# Altium schematic sheet HexSwitch.SchDoc
size A
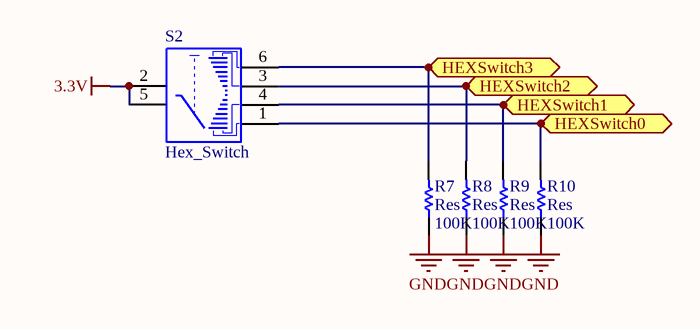
[diagram p0: HexSwitch.SchDoc]

## Parts
R7  Res  value 100K  [2012[0805]]
R8  Res  value 100K  [2012[0805]]
R9  Res  value 100K  [2012[0805]]
R10  Res  value 100K  [2012[0805]]
S2  Hex_Switch  [SW-HEX]

## Ports
HEXSwitch0 (out), HEXSwitch1 (out), HEXSwitch2 (out), HEXSwitch3 (out)

## Nets
3.3V: S2.2 S2.5
GND: R7.1 R8.1 R9.1 R10.1
HEXSwitch0: R10.2 S2.1 ; port HEXSwitch0
HEXSwitch1: R9.2 S2.4 ; port HEXSwitch1
HEXSwitch2: R8.2 S2.3 ; port HEXSwitch2
HEXSwitch3: R7.2 S2.6 ; port HEXSwitch3

## Library data of the parts
R7-R10 = Res: Semiconductor Resistor; Published: 8-Jun-2000; LatestRevisionDate: 17-Jul-2002; LatestRevisionNote: Re-released for DXP Platform.; PackageReference: AXIAL-0.5; Publisher: Altium Limited
S2 = SW-Hex: Published: 24-Mar-1999; LatestRevisionDate: 17-Jul-2002; LatestRevisionNote: Re-released for DXP Platform.; PackageReference: DIP-8; Publisher: Altium Limited